# Altium schematic sheet Port_Headers.SchDoc: Port_Headers
size Letter; Author: Nicholas J. Sorensen, and Erik F. Halliwell; Engineer: Nicholas J. Sorensen, and Erik F. HalliwellNicholas Sorensen, and Erik Halliwell; DocumentNumber: 8; SheetNumber: 8; SheetTotal: 8
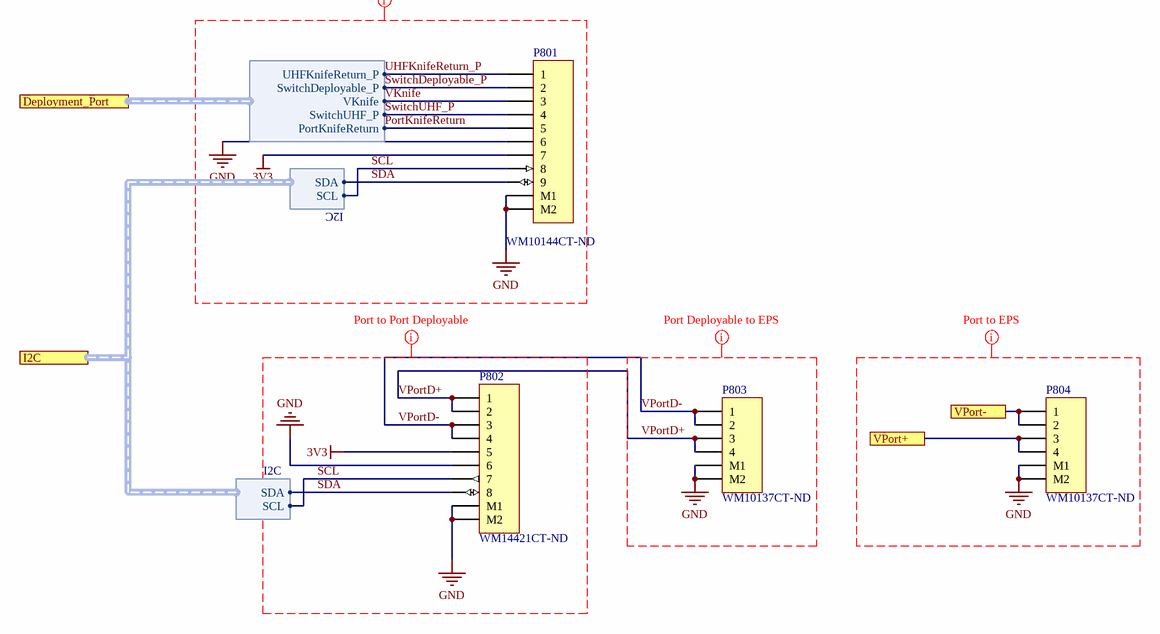
[diagram p0: Port_Headers.SchDoc]

## Parts
P801  WM10144CT-ND  [MOLX-5040500991]
P802  WM14421CT-ND  [MOLX-5040500891]
P803  WM10137CT-ND  [MOLX-5040500491]
P804  WM10137CT-ND  [MOLX-5040500491]

## Ports
Deployment_Port (harness Deployment_Port), I2C (harness I2C), VPort+, VPort-

## Harnesses
Deployment_Port: UHFKnifeReturn_P, SwitchDeployable_P, VKnife, PortKnifeReturn, SwitchUHF_P
I2C: SCL, SDA

## Nets
3V3: P801.7 P802.5
GND: P801.6 P801.M1 P801.M2 P802.6 P802.M1 P802.M2 P803.M1 P803.M2 P804.M1 P804.M2
PortKnifeReturn: P801.5 ; port Deployment_Port.PortKnifeReturn
SCL: P801.8 P802.7 ; port I2C.SCL
SDA: P801.9 P802.8 ; port I2C.SDA
SwitchDeployable_P: P801.2 ; port Deployment_Port.SwitchDeployable_P
SwitchUHF_P: P801.4 ; port Deployment_Port.SwitchUHF_P
UHFKnifeReturn_P: P801.1 ; port Deployment_Port.UHFKnifeReturn_P
VKnife: P801.3 ; port Deployment_Port.VKnife
VPort+: P804.3 P804.4 ; port VPort+
VPort-: P804.1 P804.2 ; port VPort-
VPortD+: P802.1 P802.2 P803.3 P803.4
VPortD-: P802.3 P802.4 P803.1 P803.2

## Layout directives
mark named Port Deployable to EPS: GND, VPortD+, VPortD-
mark named Port to EPS: GND
mark named Port to Athena Burnwires/I2C: 3V3, GND, PortKnifeReturn, SCL, SDA, SwitchDeployable_P, SwitchUHF_P, UHFKnifeReturn_P, VKnife
mark named Port to Port Deployable: VPortD-

## Notes on the sheet
- (the "License"); you may not use or redistribute this file except in compliance with the License. You
- This file and the information within it are licensed under the terms of the Apache License, Version 2.0
- Copyright
- Unless required by applicable law or agreed to in writing, content distributed under the License is
- distributed on an "AS IS" BASIS, WITHOUT WARRANTIES OR CONDITIONS OF ANY KIND,
- either express or implied. See the License for the specific language governing permissions and
- limitations under the License.
- may obtain a copy of the License at:
- http://www.apache.org/licenses/LICENSE-2.0
- Title
- Size:
- Date:
- Letter
- Number:
- Time:
- Revision:
- Sheet
- of
- University of Alberta
- Deptartment of Electrical
- and Computer Engineering
- Edmonton AB, Canada
- T6G 1H9
- File:

## Library data of the parts
P801 = 68: CONN HEADER SMD R/A 9POS 1.5MM; Part Number: 68; Manufacturer Part Number: 5040500991; Designator: P?; LatestRevisionDate: 17-Jul-2002; LatestRevisionNote: Re-released for DXP Platform.; Publisher: Altium Limited; Supplier Part Number 1: WM25695CT-ND; Supplier 1: Digi-Key; Supplier Link: #https://www.digikey.ca/product-detail/en/molex/5040500991/WM25695CT-ND/9954121#
P802 = 67: CONN HEADER SMD R/A 8POS 1.5MM; Part Number: 67; Manufacturer Part Number: 5040500891; Designator: P?; LatestRevisionDate: 17-Jul-2002; LatestRevisionNote: Re-released for DXP Platform.; Publisher: Altium Limited; Supplier Part Number 1: WM14421CT-ND; Supplier 1: Digi-Key; Supplier Link: #https://www.digikey.ca/product-detail/en/molex/5040500891/WM14421CT-ND/6133151#
P803 P804 = 63: CONN HEADER SMD R/A 4POS 1.5MM; Part Number: 63; Manufacturer Part Number: 5040500491; Designator: P?; LatestRevisionDate: 17-Jul-2002; LatestRevisionNote: Re-released for DXP Platform.; Publisher: Altium Limited; Supplier Part Number 1: WM10137CT-ND; Supplier 1: Digi-Key; Supplier Link: #https://www.digikey.ca/product-detail/en/molex/5040500491/WM10137CT-ND/4357653#